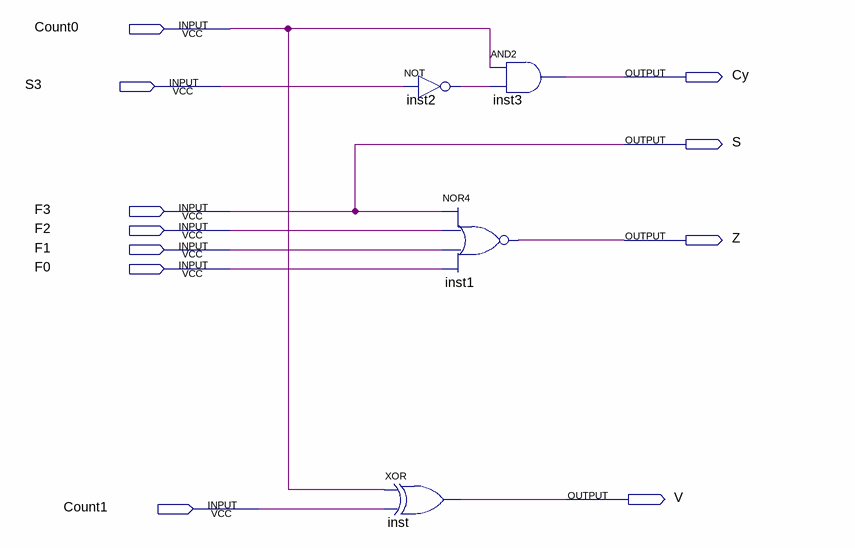
[diagram p0: schematic sheet]
// Quartus schematic state4bits.bdf as structural Verilog: 4 symbols, 11 pins
module state4bits (
  input  Count0,
  input  S3,
  input  F3,
  input  F2,
  input  F1,
  input  F0,
  input  Count1,
  output Cy,
  output S,
  output Z,
  output V
);

  wire inst2_out;

  not inst2 (inst2_out, S3);
  xor inst (V, Count0, Count1);
  and inst3 (Cy, Count0, inst2_out);
  nor inst1 (Z, F3, F2, F1, F0);

  assign S = F3;
endmodule
